# Altium schematic sheet 板球系统控制板.SchDoc
size A4
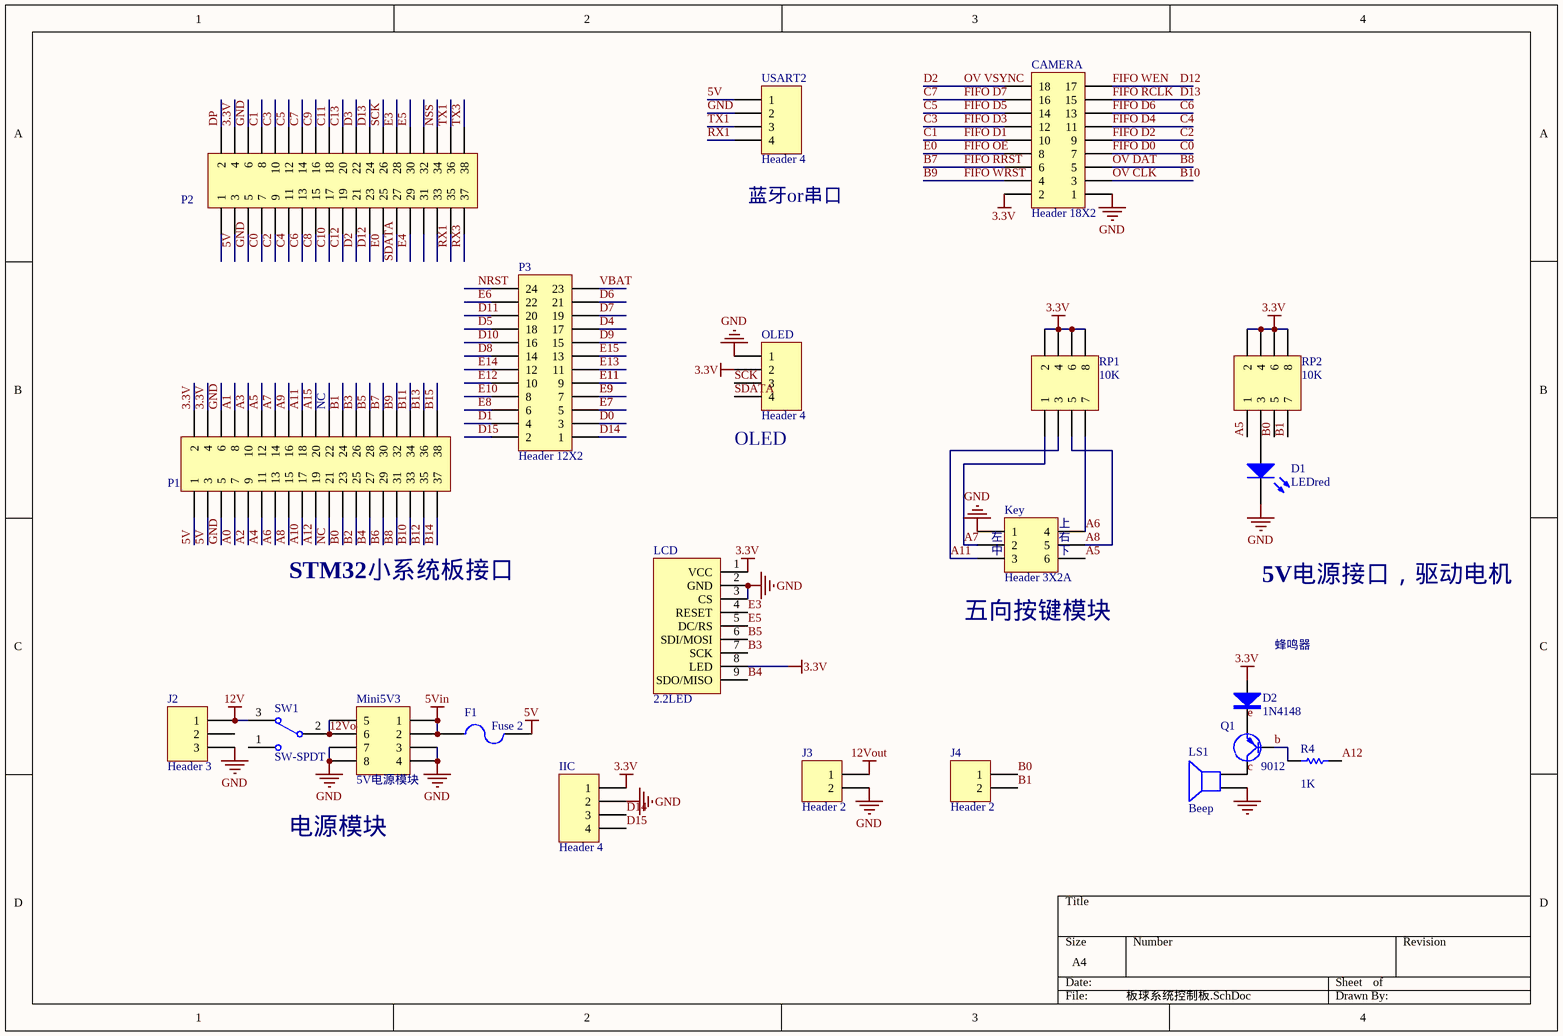
[diagram p0: 板球系统控制板.SchDoc]

## Parts
CAMERA  Header 18X2  [HDR2X9H]
D1  LEDred  [0805_LED_S4]
D2  1N4148  [SOD-123]
F1  Fuse 2  [0805]
IIC  Header 4  [sip4]
J2  Header 3  [Power]
J3  Header 2  [HDR1X2]
J4  Header 2  [HDR1X2]
Key  Header 3X2A  [Key5D]
LCD  2.2LED  [2.2LCD]
LS1  Beep  [BUFFER-12]
Mini5V3  5V电源模块  [Mini5Vpower]
OLED  Header 4  [sip4]
P1  Header 19X2  [HDR2X19]  (value not drawn)
P2  Header 19X2  [HDR2X19]  (value not drawn)
P3  Header 12X2  [HDR2X12]
Q1  9012  [SOT23]
R4  value 1K  [0805_R]  (hidden comment: Res1)
RP1  10K  [R0603_8P4R]
RP2  10K  [R0603_8P4R]
SW1  SW-SPDT  [switch2]
USART2  Header 4  [HDR1X4]

## Nets
3.3V: CAMERA.2 D2.1(A) IIC.1 LCD.1(VCC) LCD.8(LED) OLED.2 P1.2 P1.4 P2.4 RP1.2 RP1.4 RP1.6 RP1.8 RP2.2 RP2.4 RP2.6 RP2.8
5V: F1.2 P1.1 P1.3 P2.3 USART2.1
5Vin: F1.1 Mini5V3.1 Mini5V3.2
12V: J2.1 SW1.3
12Vout: J3.1 Mini5V3.5 Mini5V3.6 SW1.2
GND: CAMERA.1 D1.2(K) IIC.2 J2.3 J3.2 Key.1 LCD.2(GND) LCD.3(CS) LS1.2 Mini5V3.3 Mini5V3.4 Mini5V3.7 Mini5V3.8 OLED.1 P1.5 P1.6 P2.5 P2.6 USART2.2
A0: P1.7
A1: P1.8
A2: P1.9
A3: P1.10
A4: P1.11
A5: Key.6 P1.12 RP2.1
A6: Key.4 P1.13 RP1.7
A7: Key.2 P1.14 RP1.1
A8: Key.5 P1.15 RP1.5
A9: P1.16
A10: P1.17
A11: Key.3 P1.18 RP1.3
A12: P1.19 R4.2
A15: P1.20
b: Q1.1(B) R4.1
B0: J4.1 P1.23 RP2.5
B1: J4.2 P1.24 RP2.7
B2: P1.25
B3: LCD.7(SCK) P1.26
B4: LCD.9(SDO/MISO) P1.27
B5: LCD.6(SDI/MOSI) P1.28
B6: P1.29
B7: CAMERA.6 P1.30  [also labelled FIFO RRST]
B8: CAMERA.5 P1.31  [also labelled OV DAT]
B9: CAMERA.4 P1.32  [also labelled FIFO WRST]
B10: CAMERA.3 P1.33  [also labelled OV CLK]
B11: P1.34
B12: P1.35
B13: P1.36
B14: P1.37
B15: P1.38
c: LS1.1 Q1.3(C)
C0: CAMERA.7 P2.7  [also labelled FIFO D0]
C1: CAMERA.10 P2.8  [also labelled FIFO D1]
C2: CAMERA.9 P2.9  [also labelled FIFO D2]
C3: CAMERA.12 P2.10  [also labelled FIFO D3]
C4: CAMERA.11 P2.11  [also labelled FIFO D4]
C5: CAMERA.14 P2.12  [also labelled FIFO D5]
C6: CAMERA.13 P2.13  [also labelled FIFO D6]
C7: CAMERA.16 P2.14  [also labelled FIFO D7]
C8: P2.15
C9: P2.16
C10: P2.17
C11: P2.18
C12: P2.19
C13: P2.20
D0: P3.3
D1: P3.4
D2: CAMERA.18 P2.21  [also labelled OV VSYNC]
D3: P2.22
D4: P3.17
D5: P3.18
D6: P3.21
D7: P3.19
D8: P3.14
D9: P3.15
D10: P3.16
D11: P3.20
D12: CAMERA.17 P2.23  [also labelled FIFO WEN]
D13: CAMERA.15 P2.24  [also labelled FIFO RCLK]
D14: IIC.3 P3.1
D15: IIC.4 P3.2
DP: P2.2
e: D2.2(K) Q1.2(E)
E0: CAMERA.8 P2.25  [also labelled FIFO OE]
E3: LCD.4(RESET) P2.28
E4: P2.29
E5: LCD.5(DC/RS) P2.30
E6: P3.22
E7: P3.5
E8: P3.6
E9: P3.7
E10: P3.8
E11: P3.9
E12: P3.10
E13: P3.11
E14: P3.12
E15: P3.13
NC: P1.21
NRST: P3.24
NSS: P2.34
RX1: P2.35 USART2.4
RX3: P2.37
SCK: OLED.3 P2.26
SDATA: OLED.4 P2.27
TX1: P2.36 USART2.3
TX3: P2.38
VBAT: P3.23
NetD1_1: D1.1(A) RP2.3

Not connected (* = marked no-connect by the designer): J2 2; P1 22; P2 1 31 32 33; SW1 1

## Notes on the sheet
- (near USART2) 蓝牙or串口
- (near P1) NC
- (near OLED) OLED
- STM32小系统板接口
- (near Key) 左
- (near Key) 中
- (near Key) 上
- (near Key) 右
- (near Key) 下
- 5V电源接口，驱动电机
- (near Key) 五向按键模块
- (near D2) 蜂鸣器
- 电源模块

## Library data of the parts
CAMERA = Header 9X2: Header, 9-Pin, Dual row; LatestRevisionDate: 17-Jul-2002; LatestRevisionNote: Re-released for DXP Platform.; Publisher: Altium Limited
D1 = LED0: Typical INFRARED GaAs LED; Published: 8-Jun-2000; LatestRevisionDate: 08-Jul-2005; LatestRevisionNote: Mech Layer 1 removed.; PackageReference: LED-0; Publisher: Altium Limited
D2 = 1N4148: Diode
F1 = Fuse 2: Fuse; Published: 8-Jun-2000; LatestRevisionDate: 17-Jul-2002; LatestRevisionNote: Re-released for DXP Platform.; PackageReference: PIN-W2/E2.8; Publisher: Altium Limited
IIC OLED USART2 = Header 4: Header, 4-Pin; LatestRevisionDate: 17-Jul-2002; LatestRevisionNote: Re-released for DXP Platform.; Publisher: Altium Limited
J2 = Header 3: Header, 3-Pin; LatestRevisionDate: 17-Jul-2002; LatestRevisionNote: Re-released for DXP Platform.; Publisher: Altium Limited
J3 J4 = Header 2: Header, 2-Pin; LatestRevisionDate: 17-Jul-2002; LatestRevisionNote: Re-released for DXP Platform.; Publisher: Altium Limited
Key = Header 3X2A: Header, 3-Pin, Dual row; LatestRevisionDate: 17-Jul-2002; LatestRevisionNote: Re-released for DXP Platform.; Publisher: Altium Limited
LS1 = SPEAKER
Mini5V3 = Header 4X2A: Header, 4-Pin, Dual row; LatestRevisionDate: 17-Jul-2002; LatestRevisionNote: Re-released for DXP Platform.; Publisher: Altium Limited
P1 P2 = Header 19X2: Header, 19-Pin, Dual row; LatestRevisionDate: 17-Jul-2002; LatestRevisionNote: Re-released for DXP Platform.; Publisher: Altium Limited
P3 = Header 12X2: Header, 12-Pin, Dual row; LatestRevisionDate: 17-Jul-2002; LatestRevisionNote: Re-released for DXP Platform.; Publisher: Altium Limited
R4 = Res1: Resistor; Published: 8-Jun-2000; LatestRevisionDate: 17-Jul-2002; LatestRevisionNote: Re-released for DXP Platform.; PackageReference: AXIAL-0.3; Publisher: Altium Limited
RP1 RP2 = Header 4X2: Header, 4-Pin, Dual row; LatestRevisionDate: 17-Jul-2002; LatestRevisionNote: Re-released for DXP Platform.; Publisher: Altium Limited
SW1 = SW-SPDT: SPDT Subminiature Toggle Switch, Right Angle Mounting, Vertical Actuation; Published: 24-Mar-1999; LatestRevisionDate: 17-Dec-2003; LatestRevisionNote: Schematic revised, PCB Footprint replaced.; DatasheetDocument: 05-Dec-2000; PackageReference: TL36WW15050; Publisher: Altium Limited; ComponentLink1Description: Manufacturer Link; ComponentLink1URL: http://www.apem.com